# EAGLE schematic untitled (EAGLE 9.6.2)
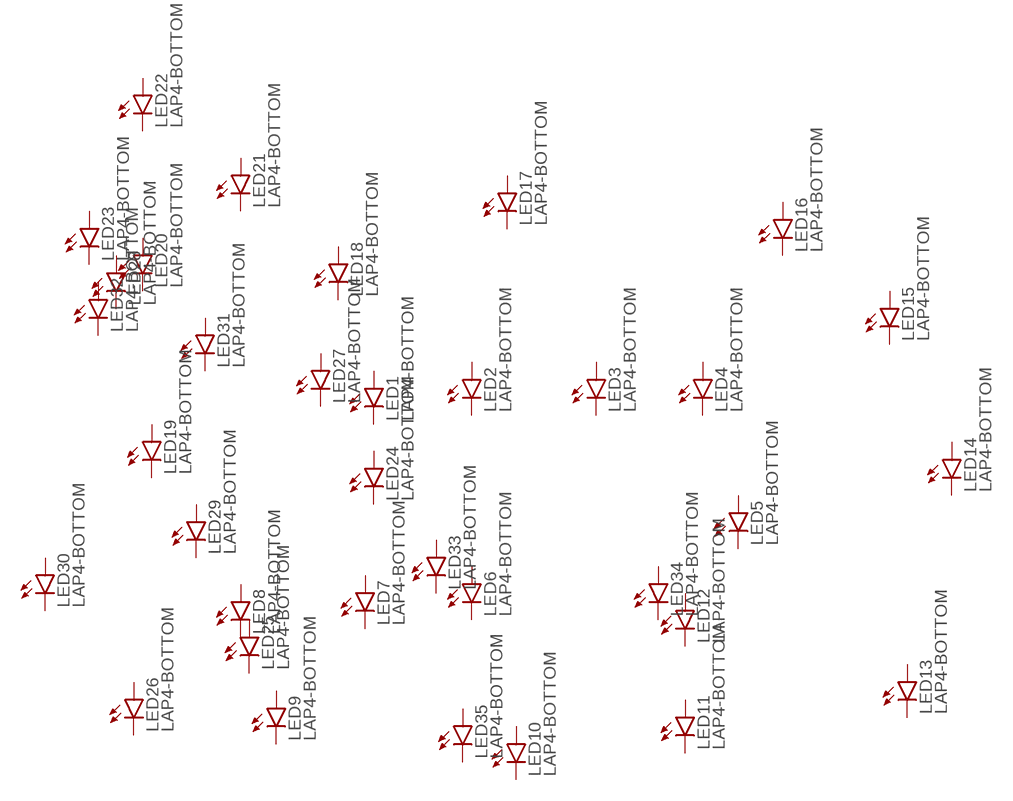
[diagram p0: schematic, sheet 1]

## Parts
LED1  LAP4-BOTTOM  [P47F-BOTTOM]
LED2  LAP4-BOTTOM  [P47F-BOTTOM]
LED3  LAP4-BOTTOM  [P47F-BOTTOM]
LED4  LAP4-BOTTOM  [P47F-BOTTOM]
LED5  LAP4-BOTTOM  [P47F-BOTTOM]
LED6  LAP4-BOTTOM  [P47F-BOTTOM]
LED7  LAP4-BOTTOM  [P47F-BOTTOM]
LED8  LAP4-BOTTOM  [P47F-BOTTOM]
LED9  LAP4-BOTTOM  [P47F-BOTTOM]
LED10  LAP4-BOTTOM  [P47F-BOTTOM]
LED11  LAP4-BOTTOM  [P47F-BOTTOM]
LED12  LAP4-BOTTOM  [P47F-BOTTOM]
LED13  LAP4-BOTTOM  [P47F-BOTTOM]
LED14  LAP4-BOTTOM  [P47F-BOTTOM]
LED15  LAP4-BOTTOM  [P47F-BOTTOM]
LED16  LAP4-BOTTOM  [P47F-BOTTOM]
LED17  LAP4-BOTTOM  [P47F-BOTTOM]
LED18  LAP4-BOTTOM  [P47F-BOTTOM]
LED19  LAP4-BOTTOM  [P47F-BOTTOM]
LED20  LAP4-BOTTOM  [P47F-BOTTOM]
LED21  LAP4-BOTTOM  [P47F-BOTTOM]
LED22  LAP4-BOTTOM  [P47F-BOTTOM]
LED23  LAP4-BOTTOM  [P47F-BOTTOM]
LED24  LAP4-BOTTOM  [P47F-BOTTOM]
LED25  LAP4-BOTTOM  [P47F-BOTTOM]
LED26  LAP4-BOTTOM  [P47F-BOTTOM]
LED27  LAP4-BOTTOM  [P47F-BOTTOM]
LED28  LAP4-BOTTOM  [P47F-BOTTOM]
LED29  LAP4-BOTTOM  [P47F-BOTTOM]
LED30  LAP4-BOTTOM  [P47F-BOTTOM]
LED31  LAP4-BOTTOM  [P47F-BOTTOM]
LED32  LAP4-BOTTOM  [P47F-BOTTOM]
LED33  LAP4-BOTTOM  [P47F-BOTTOM]
LED34  LAP4-BOTTOM  [P47F-BOTTOM]
LED35  LAP4-BOTTOM  [P47F-BOTTOM]
Unconnected: LED1.A LED1.C LED2.A LED2.C LED3.A LED3.C LED4.A LED4.C LED5.A LED5.C LED6.A LED6.C LED7.A LED7.C LED8.A LED8.C LED9.A LED9.C LED10.A LED10.C LED11.A LED11.C LED12.A LED12.C LED13.A LED13.C LED14.A LED14.C LED15.A LED15.C LED16.A LED16.C LED17.A LED17.C LED18.A LED18.C LED19.A LED19.C LED20.A LED20.C LED21.A LED21.C LED22.A LED22.C LED23.A LED23.C LED24.A LED24.C LED25.A LED25.C LED26.A LED26.C LED27.A LED27.C LED28.A LED28.C LED29.A LED29.C LED30.A LED30.C LED31.A LED31.C LED32.A LED32.C LED33.A LED33.C LED34.A LED34.C LED35.A LED35.C

## Library data of the parts
LED1-LED35 = led:*P4: PointLED® Enhanced Thinfilm LED TOP & BOTTOM mount LS P47F, LR P47F, LA P47F, LY P47F, LT P4SG, LB P4SG, LW P4SG Source: http://catalog.osram-os.com .. LA_LR_LS_LY_P47F_Pb_free.pdf